# Altium project HeaterController.PrjPcb
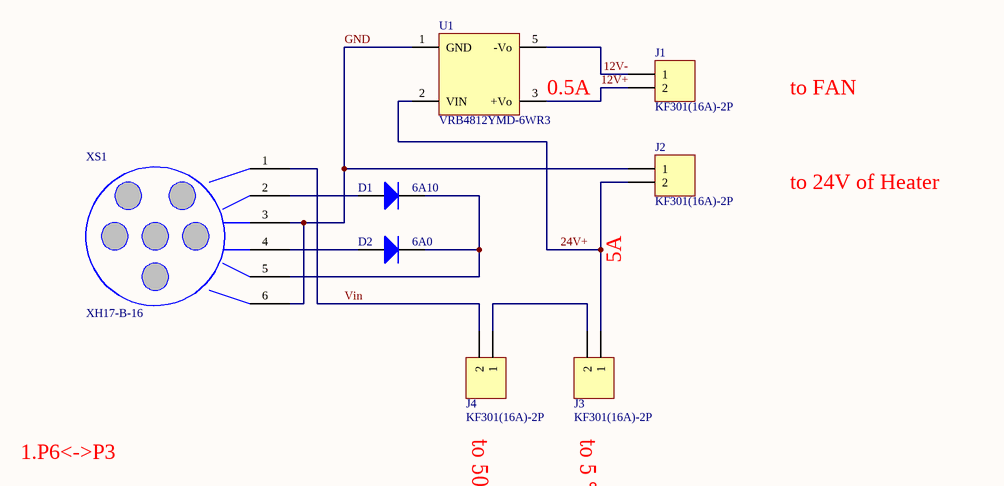
[diagram p0: HeaterController.SchDoc]
1 sheet, 8 parts. Net scope: global (net labels, ports and power ports of the same name join across sheets).
Board file: HeaterController.PcbDoc

## Sheet HeaterController.SchDoc
size A4; Organization: Altium Limited; Address1: L3, 12a Rodborough Rd; Address2: Frenchs Forest; Address3: NSW; Address4: Australia 2086

### Parts
D1  6A10  [P600(R-6)]
D2  6A0  [P600(r-6)]
J1  KF301(16A)-2P  [KF301(16A)-2P]
J2  KF301(16A)-2P  [KF301(16A)-2P]
J3  KF301(16A)-2P  [KF301(16A)-2P]
J4  KF301(16A)-2P  [KF301(16A)-2P]
U1  VRB4812YMD-6WR3  [VRB_YMD-6WR3]
XS1  XH17-B-16  [XH17-B-16]

### Nets
12V+: J1.2 U1.3(+Vo)
12V-: J1.1 U1.5(-Vo)
24V+: J2.2 J3.1 U1.2(VIN)
GND: J2.1 U1.1(GND) XS1.3 XS1.6
Vin: J4.2 XS1.1
NetD1_1: D1.1(A) XS1.2
NetD1_2: D1.2(K) D2.2(K) XS1.5
NetD2_1: D2.1(A) XS1.4
NetJ3_2: J3.2 J4.1

### Notes on the sheet
- (near U1) 0.5A
- to FAN
- to 24V of Heater
- 5A
- 1.P6<->P3
- to 50 ℃ OTP
- to 5 ℃ OTP
- Title
- Size:
- Date:
- A4
- Number:
- Time:
- Revision:
- Sheet
- of
- File:

### Library data of the parts
D1 D2 = Diode: Default Diode; Published: 8-Jun-2000; LatestRevisionDate: 17-Jul-2002; LatestRevisionNote: Re-released for DXP Platform.; PackageVersion: Sep-1996; PackageReference: SMC; Publisher: Altium Limited; PackageDescription: DO-214-AB/SMC; 2 C-Bend Leads; Body 7.9 x 5.9 mm, inc. leads (LxW); Code_JEDEC: DO-214-AB
J1-J4 = Header 2: Header, 2-Pin; LatestRevisionDate: 17-Jul-2002; LatestRevisionNote: Re-released for DXP Platform.; Publisher: Altium Limited
U1 = VRB_YMD-6WR3